# EAGLE design a4988drivers_ArduinoUNOShield_VoltageConverters (EAGLE 9.2.1)
Assembly variants: Actual
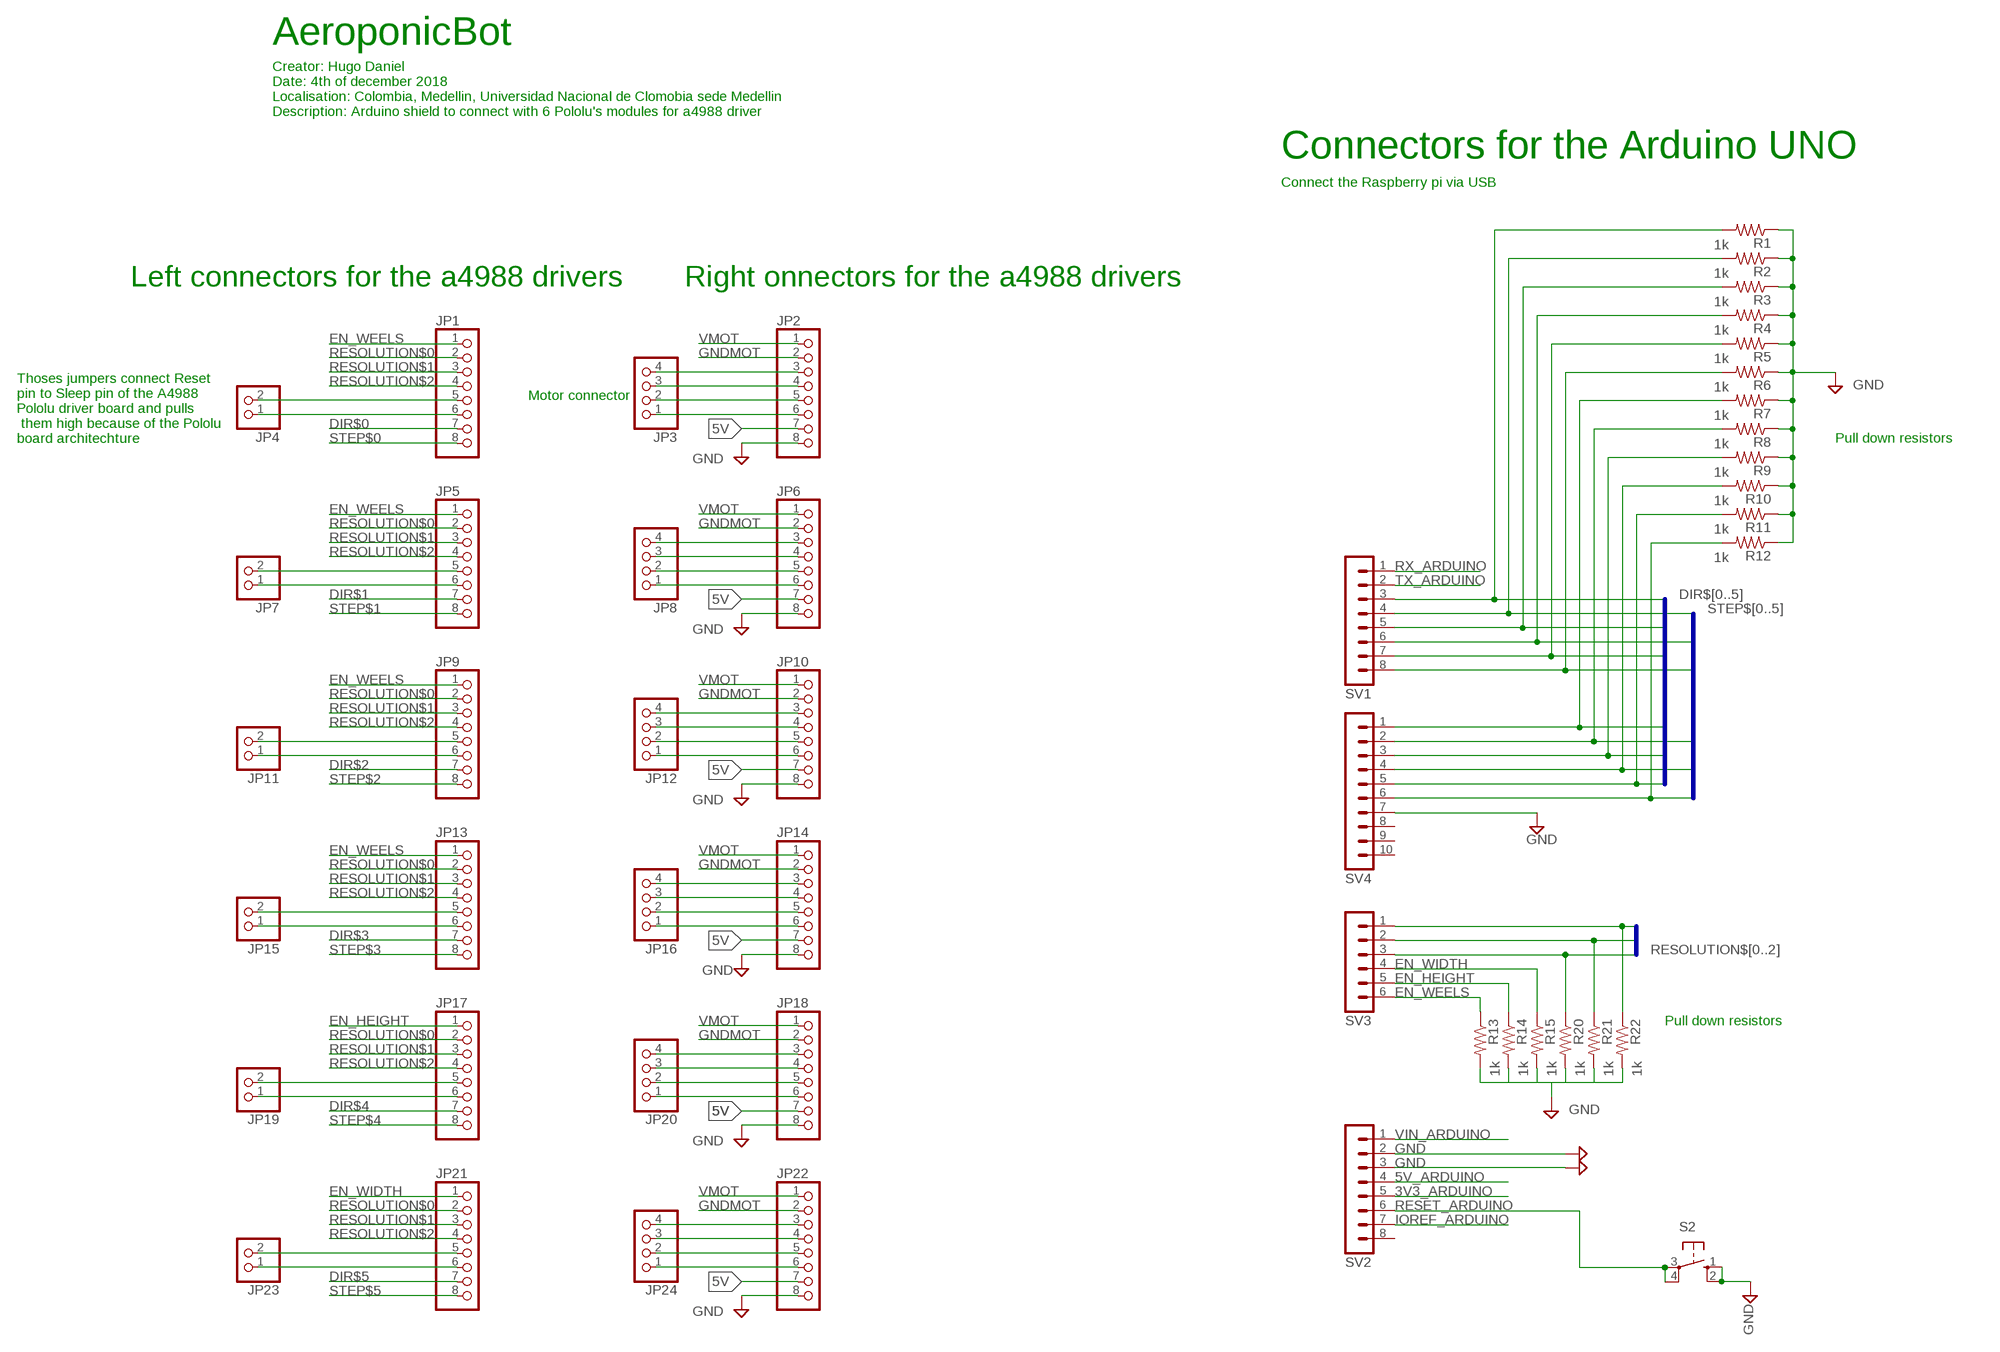
[diagram p0: schematic, sheet 1, part 1 of 2]
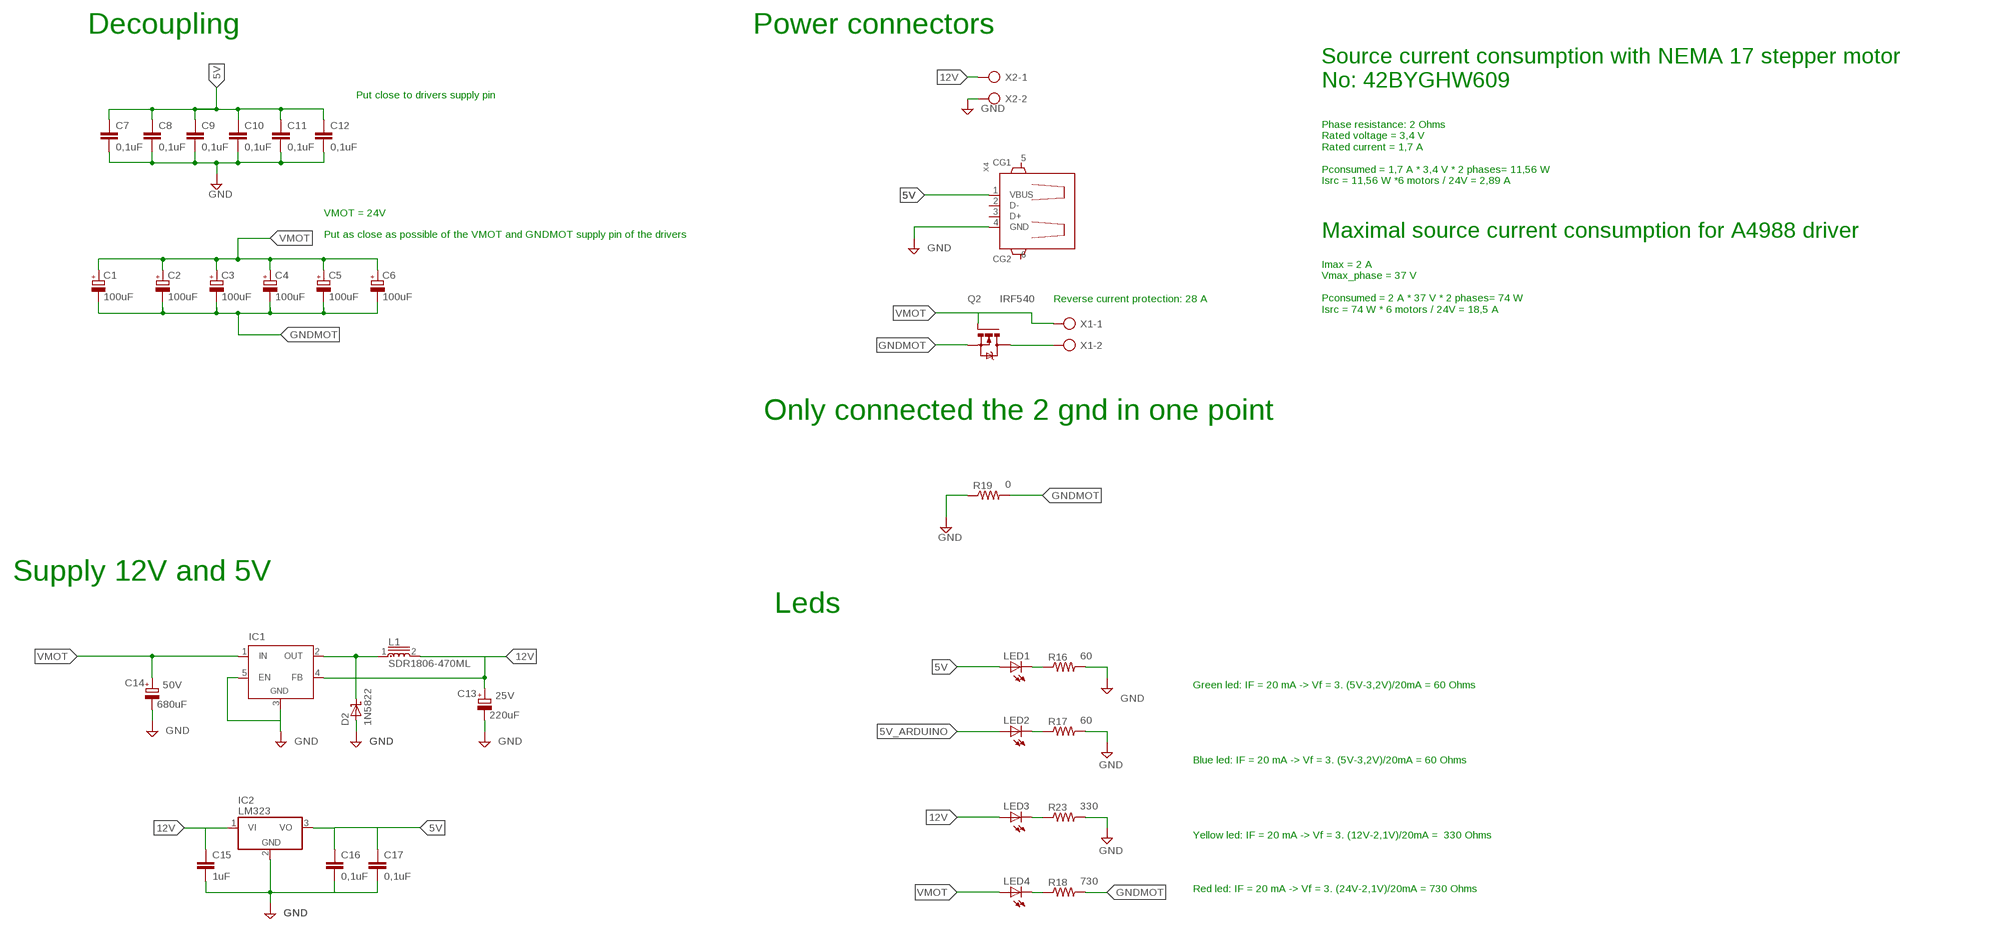
[diagram p1: schematic, sheet 1, part 2 of 2]

## Parts
C1  100uF  CPOL-EUE5-10.5  [E5-10,5]
C2  100uF  CPOL-EUE5-10.5  [E5-10,5]
C3  100uF  CPOL-EUE5-10.5  [E5-10,5]
C4  100uF  CPOL-EUE5-10.5  [E5-10,5]
C5  100uF  CPOL-EUE5-10.5  [E5-10,5]
C6  100uF  CPOL-EUE5-10.5  [E5-10,5]
C7  0,1uF  C-EU050-030X075  [C050-030X075]
C8  0,1uF  C-EU050-030X075  [C050-030X075]
C9  0,1uF  C-EU050-030X075  [C050-030X075]
C10  0,1uF  C-EU050-030X075  [C050-030X075]
C11  0,1uF  C-EU050-030X075  [C050-030X075]
C12  0,1uF  C-EU050-030X075  [C050-030X075]
C13  220uF  CPOL-EUE5-10.5  [E5-10,5]
C14  680uF  CPOL-EUE5-10.5  [E5-10,5]
C15  1uF  C-EU050-030X075  [C050-030X075]
C16  0,1uF  C-EU050-030X075  [C050-030X075]
C17  0,1uF  C-EU050-030X075  [C050-030X075]
D2  1N5822  [DIOAD2120W130L950D530P]
IC1  LM2596TV  [TO220-51]
IC2  LM323  786TV  [TO220V]
JP1  PINHD-1X8  [1X08]
JP2  PINHD-1X8  [1X08]
JP3  PINHD-1X4  [1X04]
JP4  PINHD-1X2  [1X02]
JP5  PINHD-1X8  [1X08]
JP6  PINHD-1X8  [1X08]
JP7  PINHD-1X2  [1X02]
JP8  PINHD-1X4  [1X04]
JP9  PINHD-1X8  [1X08]
JP10  PINHD-1X8  [1X08]
JP11  PINHD-1X2  [1X02]
JP12  PINHD-1X4  [1X04]
JP13  PINHD-1X8  [1X08]
JP14  PINHD-1X8  [1X08]
JP15  PINHD-1X2  [1X02]
JP16  PINHD-1X4  [1X04]
JP17  PINHD-1X8  [1X08]
JP18  PINHD-1X8  [1X08]
JP19  PINHD-1X2  [1X02]
JP20  PINHD-1X4  [1X04]
JP21  PINHD-1X8  [1X08]
JP22  PINHD-1X8  [1X08]
JP23  PINHD-1X2  [1X02]
JP24  PINHD-1X4  [1X04]
L1  SDR1806-470ML  [INDP1830X1400X690L250X260N]
LED1  LED5MM  [LED5MM]
LED2  LED5MM  [LED5MM]
LED3  LED5MM  [LED5MM]
LED4  LED5MM  [LED5MM]
Q2  IRF540  [TO220BV]
R1  1k  R-US_0207/7  [0207/7]  (not fitted in variant Actual)
R2  1k  R-US_0207/7  [0207/7]  (not fitted in variant Actual)
R3  1k  R-US_0207/7  [0207/7]  (not fitted in variant Actual)
R4  1k  R-US_0207/7  [0207/7]  (not fitted in variant Actual)
R5  1k  R-US_0207/7  [0207/7]  (not fitted in variant Actual)
R6  1k  R-US_0207/7  [0207/7]  (not fitted in variant Actual)
R7  1k  R-US_0207/7  [0207/7]  (not fitted in variant Actual)
R8  1k  R-US_0207/7  [0207/7]  (not fitted in variant Actual)
R9  1k  R-US_0207/7  [0207/7]  (not fitted in variant Actual)
R10  1k  R-US_0207/7  [0207/7]  (not fitted in variant Actual)
R11  1k  R-US_0207/7  [0207/7]  (not fitted in variant Actual)
R12  1k  R-US_0207/7  [0207/7]  (not fitted in variant Actual)
R13  1k  R-US_0207/7  [0207/7]  (not fitted in variant Actual)
R14  1k  R-US_0207/7  [0207/7]  (not fitted in variant Actual)
R15  1k  R-US_0207/7  [0207/7]  (not fitted in variant Actual)
R16  60  R-US_0207/7  [0207/7]
R17  60  R-US_0207/7  [0207/7]
R18  730  R-US_0207/7  [0207/7]
R19  0  R-US_0207/7  [0207/7]
R20  1k  R-US_0207/7  [0207/7]  (not fitted in variant Actual)
R21  1k  R-US_0207/7  [0207/7]  (not fitted in variant Actual)
R22  1k  R-US_0207/7  [0207/7]  (not fitted in variant Actual)
R23  330  R-US_0207/7  [0207/7]
S2  10-XX  [B3F-10XX]
SV1  MA08-1  [MA08-1]
SV2  MA08-1  [MA08-1]
SV3  MA06-1  [MA06-1]
SV4  MA10-1  [MA10-1]
X1  AK500/2  [AK500/2]
X2  AK500/2  [AK500/2]
X4  GHI2_USB_HOST_W/CHASSIS_GND  [GHI2_USB_HOST_HORIZONTAL_W/CHASSIS_GND]

## Nets
3V3_ARDUINO: SV2.5
5V: C7.1 C8.1 C9.1 C10.1 C11.1 C12.1 C16.1 C17.1 IC2.3(VO) JP2.7 JP6.7 JP10.7 JP14.7 JP18.7 JP22.7 LED1.A X4.1(VBUS)
5V_ARDUINO: LED2.A SV2.4
12V: C13.+ C15.1 IC1.4(FB) IC2.1(VI) L1.2 LED3.A X2.1
DIR$0: JP1.7 R1.2 SV1.3
DIR$1: JP5.7 R3.2 SV1.5
DIR$2: JP9.7 R5.2 SV1.7
DIR$3: JP13.7 R7.2 SV4.1
DIR$4: JP17.7 R9.2 SV4.3
DIR$5: JP21.7 R11.2 SV4.5
EN_HEIGHT: JP17.1 R14.1 SV3.5
EN_WEELS: JP1.1 JP5.1 JP9.1 JP13.1 R13.1 SV3.6
EN_WIDTH: JP21.1 R15.1 SV3.4
GND: C7.2 C8.2 C9.2 C10.2 C11.2 C12.2 C13.- C14.- C15.2 C16.2 C17.2 D2.A IC1.3(GND) IC1.5(EN) IC2.2(GND) JP2.8 JP6.8 JP10.8 JP14.8 JP18.8 JP22.8 R1.1 R2.1 R3.1 R4.1 R5.1 R6.1 R7.1 R8.1 R9.1 R10.1 R11.1 R12.1 R13.2 R14.2 R15.2 R16.2 R17.2 R19.1 R20.2 R21.2 R22.2 R23.2 S2.1(S) S2.2(S1) SV2.2 SV2.3 SV4.7 X2.2 X4.4(GND)
GNDMOT: C1.- C2.- C3.- C4.- C5.- C6.- JP2.2 JP6.2 JP10.2 JP14.2 JP18.2 JP22.2 Q2.S R19.2
IOREF_ARDUINO: SV2.7
N$2: D2.C IC1.2(OUT) L1.1
N$3: Q2.D X1.2
N$4: LED1.K(C) R16.1
N$5: JP2.3 JP3.4
N$6: R18.2
N$7: LED2.K(C) R17.1
N$8: JP2.4 JP3.3
N$9: JP2.5 JP3.2
N$10: JP1.5 JP4.2
N$11: JP1.6 JP4.1
N$12: JP2.6 JP3.1
N$13: JP5.5 JP7.2
N$14: JP5.6 JP7.1
N$15: JP6.3 JP8.4
N$16: JP6.4 JP8.3
N$17: JP6.5 JP8.2
N$18: JP6.6 JP8.1
N$19: JP9.5 JP11.2
N$20: JP9.6 JP11.1
N$21: JP10.3 JP12.4
N$22: JP10.4 JP12.3
N$23: JP10.5 JP12.2
N$24: JP10.6 JP12.1
N$25: JP13.5 JP15.2
N$26: JP13.6 JP15.1
N$27: JP14.3 JP16.4
N$28: JP14.4 JP16.3
N$29: JP14.5 JP16.2
N$30: JP14.6 JP16.1
N$31: JP17.5 JP19.2
N$32: JP17.6 JP19.1
N$33: JP18.3 JP20.4
N$34: JP18.4 JP20.3
N$35: JP18.5 JP20.2
N$36: JP18.6 JP20.1
N$37: JP21.5 JP23.2
N$38: JP21.6 JP23.1
N$39: JP22.3 JP24.4
N$40: JP22.4 JP24.3
N$41: JP22.5 JP24.2
N$42: JP22.6 JP24.1
N$43: LED4.K(C) R18.1
N$44: LED3.K(C) R23.1
RESET_ARDUINO: S2.3(P) S2.4(P1) SV2.6
RESOLUTION$0: JP1.2 JP5.2 JP9.2 JP13.2 JP17.2 JP21.2 R22.1 SV3.1
RESOLUTION$1: JP1.3 JP5.3 JP9.3 JP13.3 JP17.3 JP21.3 R21.1 SV3.2
RESOLUTION$2: JP1.4 JP5.4 JP9.4 JP13.4 JP17.4 JP21.4 R20.1 SV3.3
RX_ARDUINO: SV1.1
STEP$0: JP1.8 R2.2 SV1.4
STEP$1: JP5.8 R4.2 SV1.6
STEP$2: JP9.8 R6.2 SV1.8
STEP$3: JP13.8 R8.2 SV4.2
STEP$4: JP17.8 R10.2 SV4.4
STEP$5: JP21.8 R12.2 SV4.6
TX_ARDUINO: SV1.2
VIN_ARDUINO: SV2.1
VMOT: C1.+ C2.+ C3.+ C4.+ C5.+ C6.+ C14.+ IC1.1(IN) JP2.1 JP6.1 JP10.1 JP14.1 JP18.1 JP22.1 LED4.A Q2.G X1.1
Unconnected: SV2.8 SV4.8 SV4.9 SV4.10 X4.2(D-) X4.3(D+) X4.5(CG1) X4.6(CG2)

## Buses
RESOLUTION$[0..2]
STEP$[0..5]
DIR$[0..5]

## Notes on the sheet
- AeroponicBot
- Creator: Hugo Daniel
  Date: 4th of december 2018
  Localisation: Colombia, Medellin, Universidad Nacional de Clomobia sede Medellin
  Description: Arduino shield to connect with 6 Pololu's modules for a4988 driver
- Connectors for the Arduino UNO
- Connect the Raspberry pi via USB
- Left connectors for the a4988 drivers | Right onnectors for the a4988 drivers
- Decoupling | Power connectors
- Source current consumption with NEMA 17 stepper motor
  No: 42BYGHW609
- Motor connector | Put close to drivers supply pin
- Thoses jumpers connect Reset 
  pin to Sleep pin of the A4988 
  Pololu driver board and pulls
   them high because of the Pololu 
  board architechture
- Pull down resistors
- Phase resistance: 2 Ohms
  Rated voltage = 3,4 V
  Rated current = 1,7 A
  
  Pconsumed = 1,7 A * 3,4 V * 2 phases= 11,56 W
  Isrc = 11,56 W *6 motors / 24V = 2,89 A
- VMOT = 24V
- Put as close as possible of the VMOT and GNDMOT supply pin of the drivers | Maximal source current consumption for A4988 driver
- Reverse current protection: 28 A
- Imax = 2 A
  Vmax_phase = 37 V
  
  Pconsumed = 2 A * 37 V * 2 phases= 74 W
  Isrc = 74 W * 6 motors / 24V = 18,5 A
- Only connected the 2 gnd in one point
- Pull down resistors
- Supply 12V and 5V
- Leds
- Green led: IF = 20 mA -> Vf = 3. (5V-3,2V)/20mA = 60 Ohms
- Blue led: IF = 20 mA -> Vf = 3. (5V-3,2V)/20mA = 60 Ohms
- Yellow led: IF = 20 mA -> Vf = 3. (12V-2,1V)/20mA =  330 Ohms
- Red led: IF = 20 mA -> Vf = 3. (24V-2,1V)/20mA = 730 Ohms

## Library data of the parts
C1-C6 = rcl:CPOL-EU: POLARIZED CAPACITOR, European symbol; SPICEPREFIX: C
C7-C12 C15-C17 = rcl:C-EU: CAPACITOR, European symbol; SPICEPREFIX: C
C13 = rcl:CPOL-EU: POLARIZED CAPACITOR, European symbol; RATED_VOLTAGE: 25V; SPICEPREFIX: 25V
C14 = rcl:CPOL-EU: POLARIZED CAPACITOR, European symbol; RATED_VOLTAGE: 50V; SPICEPREFIX: C
D2 = 1N5822:1N5822: 1N5822 Series 40 V 3 A Through Hole Schottky Rectifier - DO-201AD; DIGI-KEY_PART_NUMBER: 1N5822FSCT-ND; DIGI-KEY_PURCHASE_URL: https://www.digikey.com/product-detail/en/on-semiconductor/1N5822/1N5822FSCT-ND/3042493?utm_source=snapeda&utm_medium=aggregator&utm_campaign=symbol; MF: ON Semiconductor; MP: 1N5822; PACKAGE: DO-201AD-201 CDIL
IC1 = linear:LM2596T: STEP-DOWN VOLTAGE REGULATOR
IC2 = linear:78*: Positive VOLTAGE REGULATOR Source: http://cache.national.com/ds/LM/LM78L05.pdf http://www.fairchildsemi.com/ds/LM/LM7805.pdf
JP1 JP2 JP5 JP6 JP9 JP10 JP13 JP14 JP17 JP18 JP21 JP22 = pinhead:PINHD-1X8: PIN HEADER
JP3 JP8 JP12 JP16 JP20 JP24 = pinhead:PINHD-1X4: PIN HEADER
JP4 JP7 JP11 JP15 JP19 JP23 = pinhead:PINHD-1X2: PIN HEADER
L1 = SDR1806-470ML:SDR1806-470ML: Inductor Power Wirewound 100uH 10% 100KHz 25Q-Factor Ferrite 1.7A 190mOhm DCR T/R; DESCRIPTION: Inductor Power Wirewound 47uH 20% 100KHz 22Q-Factor Ferrite 2.5A 95mOhm DCR T/R; DIGI-KEY_PART_NUMBER: SDR1806-470MLCT-ND; DIGI-KEY_PURCHASE_URL: https://www.digikey.com/product-detail/en/bourns-inc/SDR1806-470ML/SDR1806-470MLCT-ND/2127238?utm_source=snapeda&utm_medium=aggregator&utm_campaign=symbol; MF: Bourns; MP: SDR1806-470ML; PACKAGE: Nonstandard Bourns
LED1-LED4 = led:LED: LED OSRAM: - CHIPLED LG R971, LG N971, LY N971, LG Q971, LY Q971, LO R971, LY R971 LH N974, LH R974 LS Q976, LO Q976, LY Q976 LO Q996 - Hyper CHIPLED LW Q18S LB Q993, LB Q99A, LB R99A - SideLED LS A670, LO A670, LY A670, LG A670, LP A670 LB A673, LV A673, LT A673, LW A673 LH A674 LY A675 LS A676, LA A676, LO A676, LY A676, LW A676 LS A679, LY A679, LG A679 - Hyper Micro SIDELED® LS Y876, LA Y876, LO Y876, LY Y876 LT Y87S - SmartLED LW L88C, LW L88S LB L89C, LB L89S, LG L890 LS L89K, LO L89K, LY L89K LS L896, LA L896, LO L896, LY L896 - TOPLED LS T670, LO T670, LY T670, LG T670, LP T670 LSG T670, LSP T670, LSY T670, LOP T670, LYG T670 LG T671, LOG T671, LSG T671 LB T673, LV T673, LT T673, LW T673 LH T674 LS T676, LA T676, LO T676, LY T676, LB T676, LH T676, LSB T676, LW T676 LB T67C, LV T67C, LT T67C, LS T67K, LO T67K, LY T67K, LW E67C LS E67B, LA E67B, LO E67B, LY E67B, LB E67C, LV E67C, LT E67C LW T67C LS T679, LY T679, LG T679 LS T770, LO T770, LY T770, LG T770, LP T770 LB T773, LV T773, LT T773, LW T773 LH T774 LS E675, LA E675, LY E675, LS T675 LS T776, LA T776, LO T776, LY T776, LB T776 LHGB T686 LT T68C, LB T68C - Hyper Mini TOPLED® LB M676 - Mini TOPLED Santana® LG M470 LS M47K, LO M47K, LY M47K Source: http://www.osram.convergy.de LUXEON: - LUMILED® LXK2-PW12-R00, LXK2-PW12-S00, LXK2-PW14-U00, LXK2-PW14-V00 LXK2-PM12-R00, LXK2-PM12-S00, LXK2-PM14-U00 LXK2-PE12-Q00, LXK2-PE12-R00, LXK2-PE12-S00, LXK2-PE14-T00, LXK2-PE14-U00 LXK2-PB12-K00, LXK2-PB12-L00, LXK2-PB12-M00, LXK2-PB14-N00, LXK2-PB14-P00, LXK2-PB14-Q00 LXK2-PR12-L00, LXK2-PR12-M00, LXK2-PR14-Q00, LXK2-PR14-R00 LXK2-PD12-Q00, LXK2-PD12-R00, LXK2-PD12-S00 LXK2-PH12-R00, LXK2-PH12-S00 LXK2-PL12-P00, LXK2-PL12-Q00, LXK2-PL12-R00 Source: www.luxeon.com KINGBRIGHT: KA-3528ASYC Source: www.kingbright.com
Q2 = transistor-power:IRF540: HEXFET Power MOSFET
R1-R23 = rcl:R-US_: RESISTOR, American symbol; SPICEPREFIX: R
S2 = switch-omron:10-XX: OMRON SWITCH; MPN: B3F-1000; OC_FARNELL: 176432; OC_NEWARK: 36M3542
SV1 SV2 = con-lstb:MA08-1: PIN HEADER; OC_FARNELL: unknown; OC_NEWARK: unknown
SV3 = con-lstb:MA06-1: PIN HEADER; OC_FARNELL: unknown; OC_NEWARK: unknown
SV4 = con-lstb:MA10-1: PIN HEADER; OC_FARNELL: unknown; OC_NEWARK: unknown
X1 X2 = con-ptr500:AK500/2: CONNECTOR; OC_FARNELL: unknown; OC_NEWARK: unknown
X4 = BeagleBone_Black_Wireless:GHI2_USB_HOST_W/CHASSIS_GND

## Module ARDUINO
Ports: 

### Library data of the parts

## Board
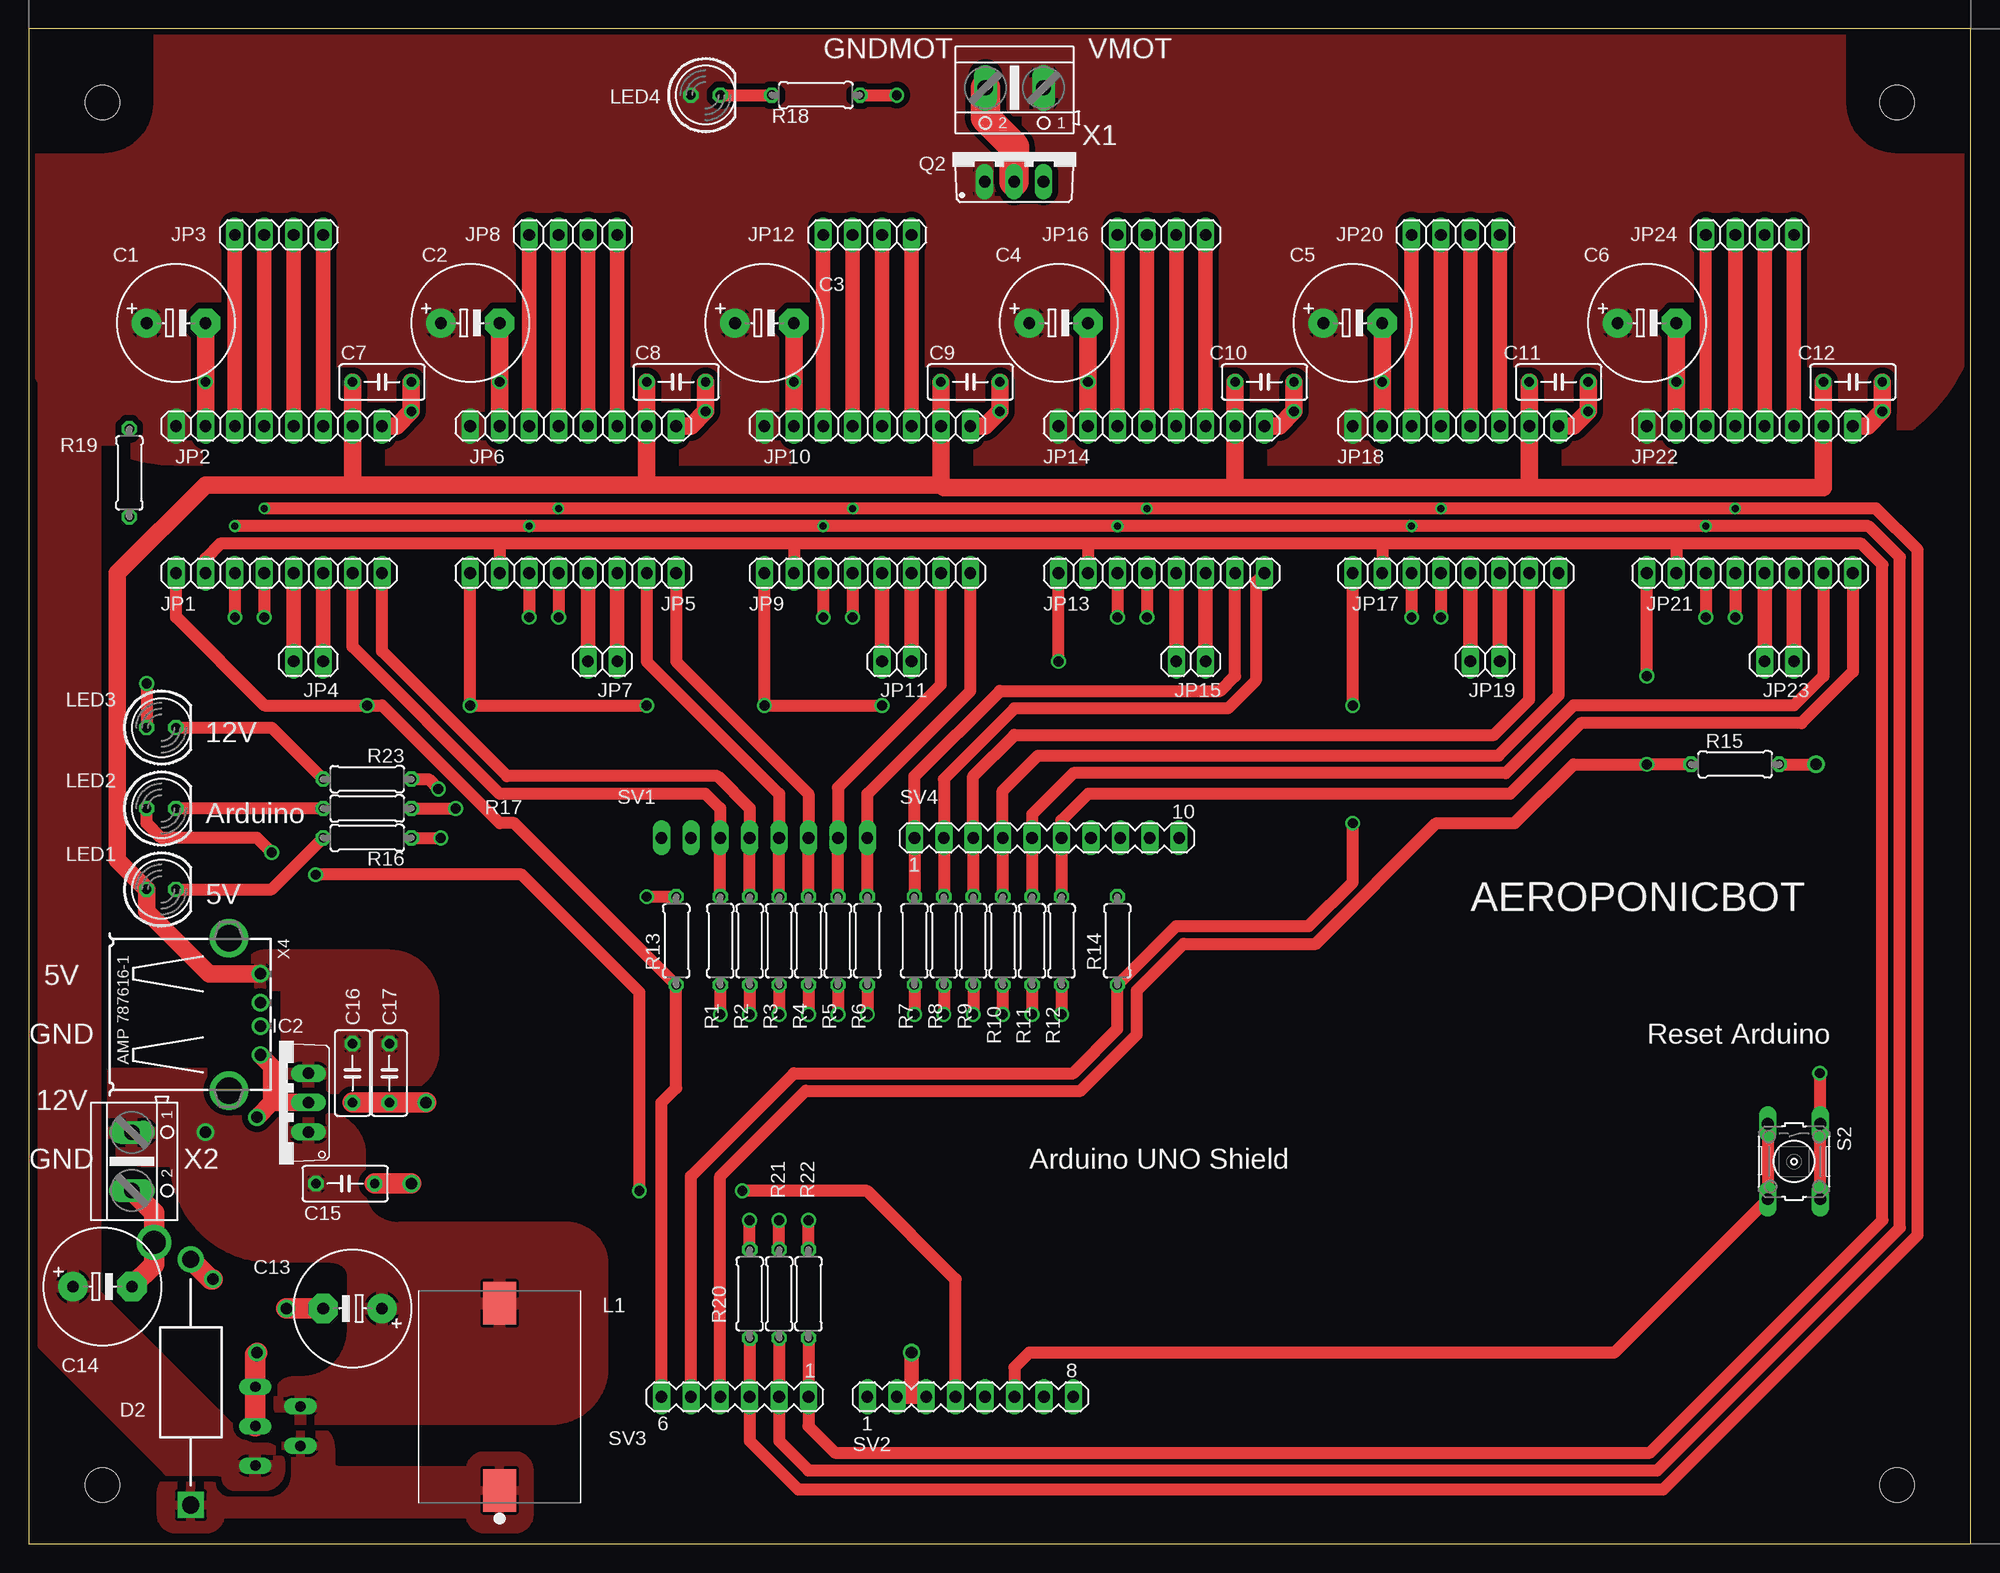
[diagram p2: board, top side]
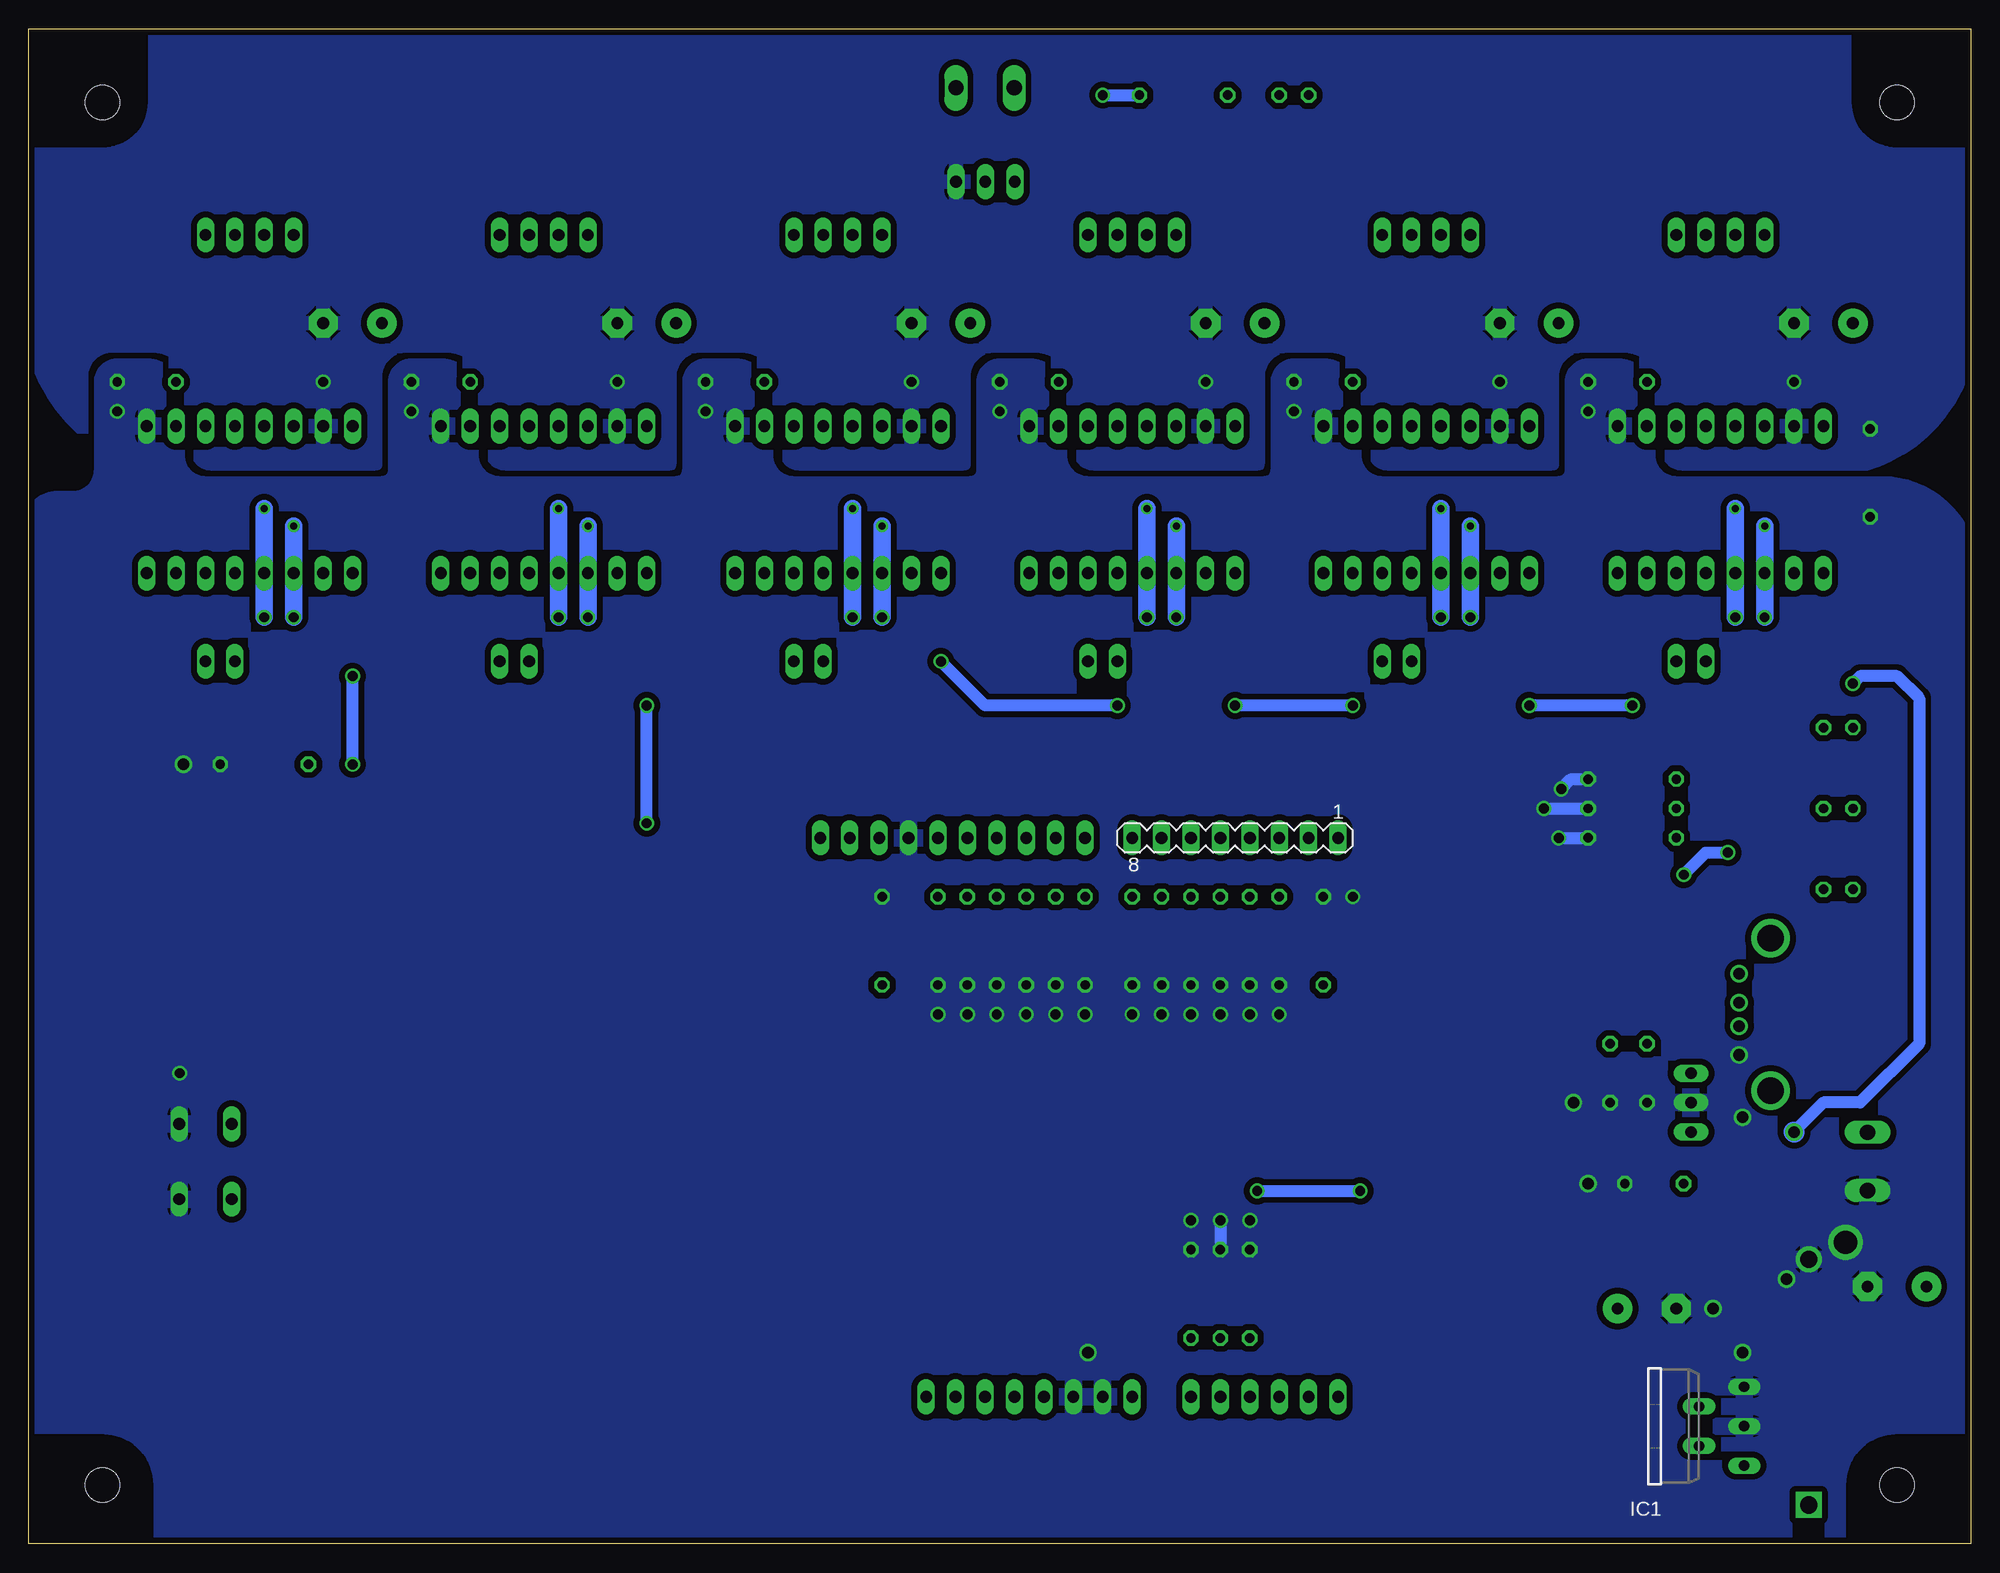
[diagram p3: board, bottom side, seen from below]

Size 167.64 x 130.81 mm. Coordinates in mm from the lower left corner, seen from the top.
Outline: 0,0 167.64,0 167.64,130.81 0,130.81 0,0
Copper layers (1*16): Top 0.035mm / dielectric 1.5mm / Bottom 0.035mm
Design rules "default *": minimum track width 20mil, minimum drill 0.6mm, track to track 20mil, track to pad 20mil, pad to pad 20mil, via to via 20mil, smd to smd 6mil, copper to edge 20mil, drill to drill 20mil, minimum pad ring 10mil, minimum via ring 8mil, stop-mask expansion 4mil, vias tented up to drill 0mil, thermal gap 10mil
Holes 3 mm at 6.35,124.46 6.35,5.08 161.29,5.08 161.29,124.46
tRestrict: area 0,120.7 to 10.2,130.8; area 157.5,120.7 to 167.6,130.8; area 157.5,0 to 167.6,8.9; area 0,0 to 10.2,8.9
bRestrict: area 0,0 to 10.2,8.9; area 157.5,0 to 167.6,8.9; area 157.5,120.7 to 167.6,130.8; area 0,120.7 to 10.2,130.8

### Footprints (pad centres in the part's own frame; a part is rotated, then mirrored left to right if it is on the bottom)
E5-10,5 = drill 1.016 pad 2.54: + -2.54,0 | drill 1.016 pad 2.54 octagon: - 2.54,0
C050-030X075 = drill 0.813 octagon: 1 -2.54,0; 2 2.54,0
DIOAD2120W130L950D530P = drill 1.5 pad 2.25: A 10.6,0 | drill 1.5 pad 2.25 square: C -10.6,0
TO220-51 = drill 0.9 long: 1 -3.4,-8.4; 2 -1.7,-4.5; 3 0,-8.4; 4 1.7,-4.5; 5 3.4,-8.4
TO220V = drill 1.016 long: 1 -2.54,-2.54; 2 0,-2.54; 3 2.54,-2.54
1X08 = drill 1.016 long: 1 -8.89,0; 2 -6.35,0; 3 -3.81,0; 4 -1.27,0; 5 1.27,0; 6 3.81,0; 7 6.35,0; 8 8.89,0
1X04 = drill 1.016 long: 1 -3.81,0; 2 -1.27,0; 3 1.27,0; 4 3.81,0
1X02 = drill 1.016 long: 1 -1.27,0; 2 1.27,0
INDP1830X1400X690L250X260N = smd 3.67 x 2.82: 1 -8.075,0; 2 8.075,0
LED5MM = drill 0.813 octagon: A -1.27,0; K 1.27,0
TO220BV = drill 1.016 long: D 0,-2.54; G -2.54,-2.54; S 2.54,-2.54
0207/7 = drill 0.813 octagon: 1 -3.81,0; 2 3.81,0
B3F-10XX = drill 1.016 long: 1 -3.251,2.261; 2 3.251,2.261; 3 -3.251,-2.261; 4 3.251,-2.261
MA08-1 = drill 1.016 long: 1 -8.89,0; 2 -6.35,0; 3 -3.81,0; 4 -1.27,0; 5 1.27,0; 6 3.81,0; 7 6.35,0; 8 8.89,0
MA06-1 = drill 1.016 long: 1 -6.35,0; 2 -3.81,0; 3 -1.27,0; 4 1.27,0; 5 3.81,0; 6 6.35,0
MA10-1 = drill 1.016 long: 1 -11.43,0; 2 -8.89,0; 3 -6.35,0; 4 -3.81,0; 5 -1.27,0; 6 1.27,0; 7 3.81,0; 8 6.35,0; 9 8.89,0; 10 11.43,0
AK500/2 = drill 1.321 long: 1 -2.515,0; 2 2.515,0
GHI2_USB_HOST_HORIZONTAL_W/CHASSIS_GND = drill 1: 1 -3.5,12.99; 2 -1,12.99; 3 1,12.99; 4 3.5,12.99 | drill 2.3: 5 -6.57,10.28; 6 6.57,10.28

### Placement (x,y rotation side)
C1  12.7,105.41 0 top
C2  38.1,105.41 0 top
C3  63.5,105.41 0 top
C4  88.9,105.41 0 top
C5  114.3,105.41 0 top
C6  139.7,105.41 0 top
C7  30.48,100.33 0 top
C8  55.88,100.33 0 top
C9  81.28,100.33 0 top
C10  106.68,100.33 0 top
C11  132.08,100.33 0 top
C12  157.48,100.33 0 top
C13  27.94,20.32 180 top
C14  6.35,22.23 0 top
C15  27.3,31.11 0 top
C16  27.94,40.64 270 top
C17  31.11,40.64 270 top
D2  13.97,13.97 90 top
IC1  27.94,10.16 90 bottom
IC2  21.59,38.1 90 top
JP1  21.59,83.82 0 top
JP2  21.59,96.52 0 top
JP3  21.59,113.03 180 top
JP4  24.13,76.2 180 top
JP5  46.99,83.82 0 top
JP6  46.99,96.52 0 top
JP7  49.53,76.2 180 top
JP8  46.99,113.03 180 top
JP9  72.39,83.82 0 top
JP10  72.39,96.52 0 top
JP11  74.93,76.2 180 top
JP12  72.39,113.03 180 top
JP13  97.79,83.82 0 top
JP14  97.79,96.52 0 top
JP15  100.33,76.2 180 top
JP16  97.79,113.03 180 top
JP17  123.19,83.82 0 top
JP18  123.19,96.52 0 top
JP19  125.73,76.2 180 top
JP20  123.19,113.03 180 top
JP21  148.59,83.82 0 top
JP22  148.59,96.52 0 top
JP23  151.13,76.2 180 top
JP24  148.59,113.03 180 top
L1  40.64,12.7 90 top
LED1  11.43,56.52 0 top
LED2  11.43,63.5 0 top
LED3  11.43,70.48 0 top
LED4  58.42,125.09 0 top
Q2  85.06,120.17 0 top
R1  59.69,52.07 90 top  (not fitted)
R2  62.23,52.07 90 top  (not fitted)
R3  64.77,52.07 90 top  (not fitted)
R4  67.31,52.07 90 top  (not fitted)
R5  69.85,52.07 90 top  (not fitted)
R6  72.39,52.07 90 top  (not fitted)
R7  76.45,52.07 90 top  (not fitted)
R8  78.99,52.07 90 top  (not fitted)
R9  81.53,52.07 90 top  (not fitted)
R10  84.07,52.07 90 top  (not fitted)
R11  86.61,52.07 90 top  (not fitted)
R12  89.15,52.07 90 top  (not fitted)
R13  55.88,52.07 90 top  (not fitted)
R14  93.98,52.07 90 top  (not fitted)
R15  147.32,67.31 0 top  (not fitted)
R16  29.21,60.96 0 top
R17  29.21,63.5 0 top
R18  67.94,125.09 0 top
R19  8.66,92.48 90 top
R20  62.23,21.59 90 top  (not fitted)
R21  64.77,21.59 90 top  (not fitted)
R22  67.31,21.59 90 top  (not fitted)
R23  29.21,66.04 0 top
S2  152.4,33.02 270 top
SV1  63.5,60.96 180 bottom
SV2  81.28,12.7 0 top
SV3  60.96,12.7 180 top
SV4  87.88,60.96 0 top
X1  85.09,125.73 180 top
X2  8.89,33.02 270 top
X4  6.99,45.72 270 top

### Tracks (layer width: path | path; a pad name or v marks a point on that pad's centre or on a via)
5V
  Top 1.524: 27.94,91.44 15.24,91.44 7.62,83.82 7.62,59.05 LED1.A 10.16,54.61 15.55,49.22 X4.1 | 27.94,91.44 JP2.7 C7.1 | 53.34,91.44 27.94,91.44 | 53.34,91.44 JP6.7 C8.1 | 53.34,91.44 78.74,91.44 | 78.74,91.44 JP10.7 C9.1 | 78.74,91.44 78.99,91.19 104.14,91.19 | 104.14,91.19 JP14.7 C10.1 | 104.14,91.19 129.54,91.19 | 129.54,91.19 JP18.7 C11.1 | 129.54,91.19 154.94,91.19 JP22.7 C12.1
  pour Top: 22.23,48.26 22.23,39.37 31.75,39.37 arc90 34.92,42.55 34.92,46.99 arc90 31.11,50.8 20.32,50.8 arc90 19.05,49.53 arc90 20.32,48.26
5V_ARDUINO  (via drill 0.85)
  Top 1.016: SV2.4 80.01,22.86 72.39,30.48 v61.59,30.48 | v52.7,30.48 52.7,47.62 42.55,57.78 v24.77,57.78 | v20.95,59.69 19.68,60.96 11.43,60.96 10.16,62.23 LED2.A
  Bottom 1.016: v61.59,30.48 v52.7,30.48 | v24.77,57.78 22.86,59.69 v20.95,59.69
12V  (via drill 0.85, 1)
  Top 1.016: v10.16,74.3 LED3.A
  Top 1.778: X2.1 8.91,35.56
  Bottom 1.016: v10.16,74.3 9.53,74.93 6.35,74.93 4.45,73.03 4.45,43.18 9.53,38.1 12.7,38.1 v15.24,35.56
  Bottom 1.778: v15.24,35.56 15.21,35.53
  pour Top (rank 5): 21.59,12.06 arc90 22.86,10.79 45.09,10.79 arc90 49.53,15.24 49.53,24.13 arc90 46.35,27.3 32.38,27.3 arc90 27.94,22.86 27.94,18.41 arc-90 23.5,13.97 22.86,13.97 arc90 21.59,12.7
  pour Top (rank 5): 28.07,22.86 arc90 26.16,24.77 20.95,24.77 arc-90 12.7,33.02 10.16,33.02 arc-90 6.35,36.83 6.35,39.37 arc-90 7.62,40.64 18.41,40.64 arc-90 21.59,37.47 arc90 22.23,36.83 25.4,36.83 arc-90 28.57,33.66 28.57,30.48 arc90 31.75,27.3 34.29,27.3 34.29,22.86
DIR$0
  Top 1.016: JP1.7 27.94,77.47 40.64,64.77 58.42,64.77 59.69,63.5 SV1.3 R1.2
DIR$1
  Top 1.016: JP5.7 53.34,76.2 64.77,64.77 SV1.5 R3.2
DIR$2
  Top 1.016: JP9.7 78.74,74.19 69.85,65.3 SV1.7 R5.2
DIR$3
  Top 1.016: JP13.7 104.14,74.93 102.87,73.66 83.82,73.66 76.45,66.29 SV4.1 R7.2
DIR$4
  Top 1.016: JP17.7 129.54,72.89 126.5,69.85 85.09,69.85 81.53,66.29 SV4.3 R9.2
DIR$5
  Top 1.016: JP21.7 154.94,74.93 152.4,72.39 133.35,72.39 127.51,66.55 90.17,66.55 86.61,62.99 SV4.5 R11.2
EN_HEIGHT  (via drill 0.85)
  Top 1.016: SV3.5 57.15,31.75 66.04,40.64 90.17,40.64 93.98,44.45 R14.1 99.06,53.34 110.49,53.34 114.3,57.15 v114.3,62.23 | v114.3,72.39 JP17.1
  Bottom 1.016: v114.3,62.23 v114.3,72.39
EN_WEELS  (via drill 0.85)
  Top 1.016: JP1.1 12.7,80.01 20.32,72.39 v29.21,72.39 30.48,72.39 40.64,62.23 41.91,62.23 R13.1 55.88,39.37 54.61,38.1 SV3.6 | JP5.1 v38.1,72.39 v53.34,72.39 | JP9.1 v63.5,72.39 v73.66,72.39 | v88.9,76.2 JP13.1
  Bottom 1.016: v29.21,72.39 v38.1,72.39 | v53.34,72.39 v63.5,72.39 | v73.66,72.39 85.09,72.39 v88.9,76.2
EN_WIDTH  (via drill 0.85)
  Top 1.016: SV3.4 59.69,31.75 67.06,39.12 90.8,39.12 95.66,43.97 95.66,47.78 99.69,51.82 111.12,51.82 121.53,62.23 128.27,62.23 133.35,67.31 v139.7,67.31 R15.1 | v139.7,74.93 JP21.1
  Bottom 1.016: v139.7,67.31 v139.7,74.93
GND  (via drill 0.85, 1, 2)
  Top 1.016: R1.1 v59.69,45.72 | R2.1 v62.23,45.72 | R3.1 v64.77,45.72 | R4.1 v67.31,45.72 | R5.1 v69.85,45.72 | R6.1 v72.39,45.72 | R7.1 v76.45,45.72 | R8.1 v78.99,45.72 | R9.1 v81.53,45.72 | R10.1 v84.07,45.72 | R11.1 v86.61,45.72 | R12.1 v89.15,45.72 | S2.2 S2.1 154.66,40.62 v154.63,40.64 | R21.2 v64.77,27.94 | R22.2 v67.31,27.94 | R13.2 v53.34,55.88 | R23.2 34.49,66.04 v35.34,65.19 | R17.2 v36.83,63.5 | R16.2 v35.56,60.96 | R20.2 v62.23,27.94 | R15.2 v154.31,67.31
  Top 1.27: SV2.3 76.2,12.7 | 76.2,12.7 v76.2,16.51 | SV2.2 76.2,12.7
  Top 1.524: JP2.8 31.75,96.52 v33.02,97.79 C7.2 | JP6.8 57.15,96.52 v58.42,97.79 C8.2 | JP10.8 82.55,96.52 v83.82,97.79 C9.2 | JP14.8 107.95,96.52 v109.22,97.79 C10.2 | JP18.8 133.35,96.52 v134.62,97.79 C11.2 | JP22.8 158.75,96.52 v160.02,97.79 C12.2 | X4.4 20.95,41.24 20.95,38.1 | 20.95,38.1 v19.68,36.83 | IC2.2 20.95,38.1
  Top 1.778: X2.2 10.79,28.6 v10.79,26.04 10.79,24.13 C14.- | D2.A 15.68,22.86 v15.88,22.86 | IC1.3 IC1.5 19.54,16.36 v19.68,16.51 | C13.- v22.23,20.32 | C15.2 v33.02,31.11 | C16.2 C17.2 v34.29,38.1
  Bottom 1.016: v64.77,27.94 R21.2 | v35.34,65.19 34.49,66.04 R23.2 | v36.83,63.5 R17.2 | v35.56,60.96 R16.2
  pour Bottom (isolate 0.508): 0,0 0,83.82 arc-90 7.62,91.44 25.4,91.44 arc90 27.94,93.98 27.94,99.06 arc-90 30.48,101.6 33.02,101.6 arc-90 34.29,100.33 34.29,92.71 arc90 35.56,91.44 36.83,91.44 50.8,91.44 arc90 53.34,93.98 53.34,99.06 arc-90 55.88,101.6 58.42,101.6 arc-90 59.69,100.33 59.69,92.71 arc90 60.96,91.44 62.23,91.44 76.2,91.44 arc90 78.74,93.98 78.74,99.06 arc-90 81.28,101.6 83.82,101.6 arc-90 85.09,100.33 85.09,97.79 85.09,92.71 arc90 86.36,91.44 88.9,91.44 101.6,91.44 arc90 104.14,93.98 104.14,99.06 arc-90 106.68,101.6 109.22,101.6 arc-90 110.49,100.33 110.49,99.06 110.49,92.71 arc90 111.76,91.44 113.03,91.44 127,91.44 arc90 129.54,93.98 129.54,99.06 arc-90 132.08,101.6 134.62,101.6 arc-90 135.89,100.33 135.89,99.06 135.89,92.71 arc90 137.16,91.44 138.43,91.44 152.4,91.44 arc90 154.94,93.98 154.94,96.52 154.94,99.06 arc-90 157.48,101.6 160.02,101.6 arc-90 161.29,100.33 161.29,92.71 arc90 163.83,90.17 165.1,90.17 arc-90 167.64,87.63 167.64,86.36 167.64,0
GNDMOT  (via drill 0.85)
  Top 1.524: JP2.2 v15.24,100.33 C1.- | JP6.2 v40.64,100.33 C2.- | JP10.2 v66.04,100.33 C3.- | JP14.2 v91.44,100.33 C4.- | JP18.2 v116.84,100.33 C5.- | JP22.2 v142.24,100.33 C6.-
  pour Bottom (rank 2): 0,130.81 0,105.41 arc90 12.7,92.71 16.51,92.71 153.67,92.71 arc90 167.64,106.68 167.64,130.81
N$2
  pour Top (rank 6): 16.51,4.45 22.23,4.45 22.23,8.89 arc-90 23.5,10.16 24.13,10.16 arc-90 26.04,8.26 26.04,6.99 arc90 26.67,6.35 38.1,6.35 arc-90 39.37,7.62 41.91,7.62 arc-90 43.18,6.35 43.18,2.54 arc-90 41.91,1.27 39.37,1.27 arc-90 38.1,2.54 16.51,2.54 arc-90 15.24,1.27 12.7,1.27 arc-90 11.43,2.54 11.43,4.45 arc-90 12.7,5.71 15.24,5.71 arc-90
N$3
  Top 2.54: X1.2 82.58,123.17 85.09,120.65 85.09,119.47 85.06,119.44 Q2.D
N$4
  Top 1.016: LED1.K 20.95,56.52 R16.1
N$5
  Top 1.27: JP2.3 JP3.4
N$6  (via drill 0.85)
  Top 1.016: R18.2 v74.93,125.09
  Bottom 1.016: v74.93,125.09 R18.2
N$7
  Top 1.016: R17.1 LED2.K
N$8
  Top 1.27: JP2.4 JP3.3
N$9
  Top 1.27: JP2.5 JP3.2
N$10
  Top 1.27: JP4.2 JP1.5
N$11
  Top 1.27: JP4.1 JP1.6
N$12
  Top 1.27: JP2.6 JP3.1
N$13
  Top 1.27: JP7.2 JP5.5
N$14
  Top 1.27: JP7.1 JP5.6
N$15
  Top 1.27: JP6.3 JP8.4
N$16
  Top 1.27: JP6.4 JP8.3
N$17
  Top 1.27: JP6.5 JP8.2
N$18
  Top 1.27: JP6.6 JP8.1
N$19
  Top 1.27: JP11.2 JP9.5
N$20
  Top 1.27: JP11.1 JP9.6
N$21
  Top 1.27: JP10.3 JP12.4
N$22
  Top 1.27: JP10.4 JP12.3
N$23
  Top 1.27: JP10.5 JP12.2
N$24
  Top 1.27: JP10.6 JP12.1
N$25
  Top 1.27: JP15.2 JP13.5
N$26
  Top 1.27: JP15.1 JP13.6
N$27
  Top 1.27: JP14.3 JP16.4
N$28
  Top 1.27: JP14.4 JP16.3
N$29
  Top 1.27: JP14.5 JP16.2
N$30
  Top 1.27: JP14.6 JP16.1
N$31
  Top 1.27: JP19.2 JP17.5
N$32
  Top 1.27: JP19.1 JP17.6
N$33
  Top 1.27: JP18.3 JP20.4
N$34
  Top 1.27: JP18.4 JP20.3
N$35
  Top 1.27: JP18.5 JP20.2
N$36
  Top 1.27: JP18.6 JP20.1
N$37
  Top 1.27: JP23.2 JP21.5
N$38
  Top 1.27: JP23.1 JP21.6
N$39
  Top 1.016: JP22.3 JP24.4
N$40
  Top 1.27: JP22.4 JP24.3
N$41
  Top 1.27: JP22.5 JP24.2
N$42
  Top 1.27: JP22.6 JP24.1
N$43
  Top 1.016: LED4.K R18.1
N$44
  Top 1.016: LED3.K 20.95,70.48 R23.1
RESET_ARDUINO
  Top 1.016: SV2.6 85.09,15.24 86.36,16.51 136.88,16.51 S2.4 S2.3
RESOLUTION$0
  Top 1.016: JP1.2 15.24,85.09 16.51,86.36 40.64,86.36 | 142.24,86.36 158.22,86.36 160.02,84.56 160.02,27.94 139.95,7.87 69.6,7.87 67.31,10.16 SV3.1 R22.1 | 142.24,86.36 116.84,86.36 | 116.84,86.36 91.44,86.36 | 91.44,86.36 66.04,86.36 | 66.04,86.36 40.64,86.36 | 40.64,86.36 JP5.2 | 66.04,86.36 JP9.2 | 91.44,86.36 JP13.2 | 116.84,86.36 JP17.2 | 142.24,86.36 JP21.2
RESOLUTION$1  (via drill 0.6, 0.85)
  Top 1.016: v17.78,87.88 v43.18,87.88 v68.58,87.88 v93.98,87.88 v119.38,87.88 v144.78,87.88 158.85,87.88 161.54,85.19 161.54,27.31 140.59,6.35 67.31,6.35 64.77,8.89 SV3.2 R21.1 | JP21.3 v144.78,80.01 | JP17.3 v119.38,80.01 | JP13.3 v93.98,80.01 | JP9.3 v68.58,80.01 | JP5.3 v43.18,80.01 | JP1.3 v17.78,80.01
  Bottom 1.524: v17.78,87.88 JP1.3 v17.78,80.01 | v43.18,87.88 JP5.3 v43.18,80.01 | v68.58,87.88 JP9.3 v68.58,80.01 | v93.98,87.88 JP13.3 v93.98,80.01 | v119.38,87.88 JP17.3 v119.38,80.01 | v144.78,87.88 JP21.3 v144.78,80.01
RESOLUTION$2  (via drill 0.6, 0.85)
  Top 1.016: v20.32,89.41 v45.72,89.41 v71.12,89.41 v96.52,89.41 v121.92,89.41 v147.32,89.41 159.48,89.41 163.07,85.82 163.07,26.68 141.09,4.7 66.42,4.7 62.23,8.89 SV3.3 R20.1 | JP21.4 v147.32,80.01 | JP17.4 v121.92,80.01 | JP13.4 v96.52,80.01 | JP9.4 v71.12,80.01 | JP5.4 v45.72,80.01 | JP1.4 v20.32,80.01
  Bottom 1.524: v20.32,89.41 JP1.4 v20.32,80.01 | v45.72,89.41 JP5.4 v45.72,80.01 | v71.12,89.41 JP9.4 v71.12,80.01 | v96.52,89.41 JP13.4 v96.52,80.01 | v121.92,89.41 JP17.4 v121.92,80.01 | v147.32,89.41 JP21.4 v147.32,80.01
STEP$0
  Top 1.016: JP1.8 30.48,77.08 41.27,66.29 59.44,66.29 62.23,63.5 SV1.4 R2.2
STEP$1
  Top 1.016: JP5.8 55.88,76.2 67.31,64.77 SV1.6 R4.2
STEP$2
  Top 1.016: JP9.8 81.28,73.66 72.39,64.77 SV1.8 R6.2
STEP$3
  Top 1.016: JP13.8 105.92,83.06 105.92,74.55 103.5,72.14 85.09,72.14 78.99,66.04 SV4.2 R8.2
STEP$4
  Top 1.016: JP17.8 132.08,73.28 126.88,68.07 87.12,68.07 84.07,65.02 SV4.4 R10.2
STEP$5
  Top 1.016: JP21.8 157.48,75.31 153.03,70.87 133.98,70.87 127.89,64.77 91.44,64.77 89.15,62.48 SV4.6 R12.2
VMOT
  pour Top (isolate 0.508, rank 2): 0,130.81 0,106.68 arc90 12.7,93.98 153.67,93.98 arc90 167.64,107.95 167.64,130.81
  pour Top (rank 2): 19.05,8.26 20.32,8.26 arc-90 21.59,6.99 21.59,6.35 arc-90 20.32,5.08 19.68,5.08 17.78,5.08 arc-90 17.14,5.71 arc90 16.51,6.35 15.88,6.35 12.06,6.35 1.27,17.14 1.27,22.23 1.27,106.05 5.71,106.05 5.71,62.23 5.71,21.59

### Text on the board
tPlace: GNDMOT | VMOT | 12V | Arduino | 5V | 5V | GND | Reset Arduino | 12V | GND | Arduino UNO Shield
tDocu: Pull down resistors
_tsilk: AEROPONICBOT